# EAGLE design working (EAGLE 9.5.1)
COMPANY: ADAFRUIT INDUSTRIES; DRAWN: KTOWN; REV: A
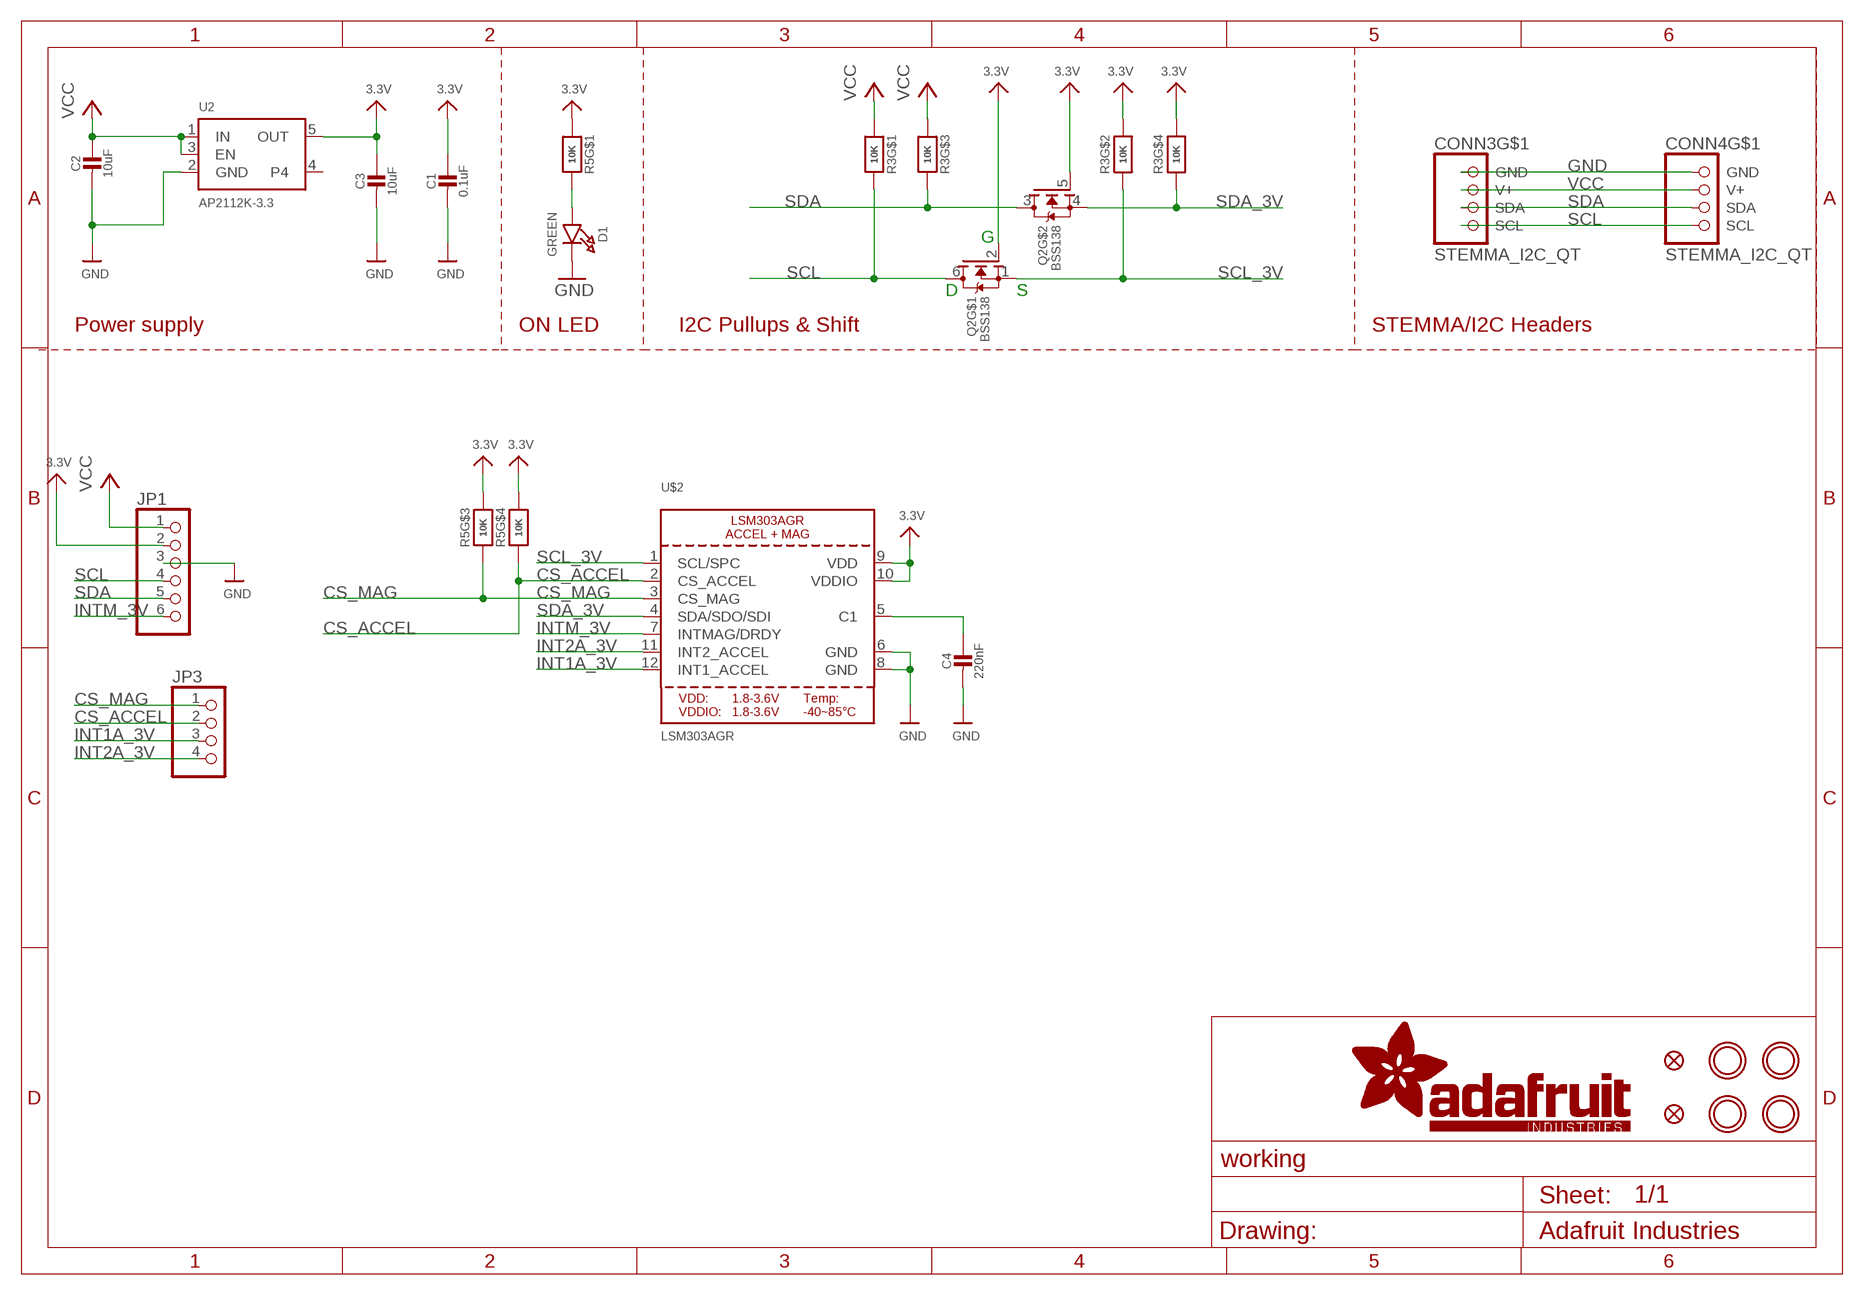
[diagram p0: schematic, sheet 1]

## Parts
C1  0.1uF  CAP_CERAMIC0603_NO  [0603-NO@1]
C2  10uF  CAP_CERAMIC0805-NOOUTLINE  [0805-NO]
C3  10uF  CAP_CERAMIC0805_10MGAP  [0805_10MGAP]
C4  220nF  CAP_CERAMIC0603_NO  [0603-NO@1]
CONN3  STEMMA_I2C_QT  [JST_SH4]
CONN4  STEMMA_I2C_QT  [JST_SH4]
D1  GREEN  LED0603_NOOUTLINE  [CHIPLED_0603_NOOUTLINE]
FID3  FIDUCIAL_1MM  [FIDUCIAL_1MM]
FID4  FIDUCIAL_1MM  [FIDUCIAL_1MM]
JP1  HEADER-1X670MIL  [1X06_ROUND_70]
JP3  HEADER-1X4ROUND  [1X04_ROUND]
Q2  BSS138  MOSFET-N_DUAL  [SOT363]
R3  10K  RESISTOR_4PACK  [RESPACK_4X0603]
R5  10K  RESISTOR_4PACK  [RESPACK_4X0603]
U2  AP2112K-3.3  VREG_SOT23-5  [SOT23-5]
U$1  MOUNTINGHOLE2.5  [MOUNTINGHOLE_2.5_PLATED]
U$2  LSM303AGR  [LGA12_2X2MM]
U$17  MOUNTINGHOLE2.5  [MOUNTINGHOLE_2.5_PLATED]
U$19  MOUNTINGHOLE2.5  [MOUNTINGHOLE_2.5_PLATED]
U$21  MOUNTINGHOLE2.5  [MOUNTINGHOLE_2.5_PLATED]

## Nets
3.3V [lowpower]: C1.1 C3.1 JP1.2 Q2.2(G) Q2.5(G) R3.2 R3.4 R5.1 R5.5 R5.6 U2.5(OUT) U$2.9(VDD) U$2.10(VDDIO)
CS_ACCEL: JP3.2 R5.4 U$2.2(CS_ACCEL)
CS_MAG: JP3.1 R5.3 U$2.3(CS_MAG)
GND [highpower]: C1.2 C2.2 C3.2 C4.2 CONN3.1(GND) CONN4.1(GND) D1.C JP1.3 U2.2(GND) U$2.6(GND) U$2.8(GND)
INT1A_3V: JP3.3 U$2.12(INT1_ACCEL)
INT2A_3V: JP3.4 U$2.11(INT2_ACCEL)
INTM_3V: JP1.6 U$2.7(INTMAG/DRDY)
N$1: D1.A R5.8
N$2: C4.1 U$2.5(C1)
SCL: CONN3.4(SCL) CONN4.4(SCL) JP1.4 Q2.6(D) R3.8
SCL_3V: Q2.1(S) R3.7 U$2.1(SCL/SPC)
SDA: CONN3.3(SDA) CONN4.3(SDA) JP1.5 Q2.3(D) R3.6
SDA_3V: Q2.4(S) R3.5 U$2.4(SDA/SDO/SDI)
VCC [highpower]: C2.1 CONN3.2(V+) CONN4.2(V+) JP1.1 R3.1 R3.3 U2.1(IN) U2.3(EN)
Unconnected: CONN3.MT1(MT) CONN3.MT2(MT) CONN4.MT1(MT) CONN4.MT2(MT) R5.2 R5.7 U2.4

## Notes on the sheet
- G
- D | S
- Power supply | ON LED | I2C Pullups & Shift | STEMMA/I2C Headers

## Library data of the parts
C1-C4 = microbuilder:CAP_CERAMIC: Ceramic Capacitors For new designs, use the packages preceded by an '_' character since they are more reliable: The following footprints should be used on most boards: _0402 - Standard footprint for regular board layouts _0603 - Standard footprint for regular board layouts _0805 - Standard footprint for regular board layouts _1206 - Standard footprint for regular board layouts For extremely tight-pitch boards where space is at a premium, the following 'micro-pitch' footprints can be used (smaller pads, no silkscreen outline, etc.): _0402MP - Micro-pitch footprint for very dense/compact boards _0603MP - Micro-pitch footprint for very dense/compact boards _0805MP - Micro-pitch footprint for very dense/compact boards _1206MP - Micro-pitch footprint for very dense/compact boards
CONN3 CONN4 = microbuilder:STEMMA_I2C
D1 = microbuilder:LED: LED 0603 - 0603 Surface Mount Package 2mA: Green LED - Low Power (3.9mcd, 2ma, 1.7Vf) - Digikey: 475-2709-2-ND Orange LED - Low Power (9.8mcd, 2ma, 1.8Vf) - Digikey: 475-1194-2-ND Red LED - Low Power (5mcd, 2ma, 1.8Vf) - Digikey: 475-1195-2-ND Yellow LED - Low Power (7mcd, 2ma, 1.8Vf) - Digikey: 475-1196-2-ND 5mA: Blue LED - Low Power (17mcd, 5ma, 2.9Vf) - Digikey: LNJ937W8CRACT-ND 0805 - 0805 Surface Mount Package 2mA: Red LED (8.8mcd, 2mA, 1.8Vf, Clear) - Low Power [Digikey: 475-2510-1-ND] Green LED (5mcd, 2mA, 1.8Vf, Clear) - Low Power [Digikey: 475-2730-1-ND] Yellow LED (11.3mcd, 2mA, 1.8Vf, Clear) - Low Power [Digikey: 475-2555-1-ND] 20mA: Red LED (104mcd, 20mA, Diffused) - LS R976 [Digikey: 475-1278-6-ND] Red LED (12mcd, 20mA, 2.0Vf, Clear) - APT2012EC [Digikey: 754-1128-1-ND] Green LED (15mcd, 20mA, 2.2Vf, Clear) - APT2012GC [Digikey: 754-1131-1-ND] Orange LED (160mcd, 20mA, 2.1Vf, Clear) - APT2012SECK [Digikey: 754-1130-1-ND] 1206 - 1206 Surface Mount Package Green LED (26mcd, 20mA, Diffused) - LG N971 [Digikey: 475-1407-6-ND] Red LED (15mcd, 20mA, Diffused) - LH N974 [Digikey: 475-1416-6-ND] Cree - Cree High-Power Surface Mount LEDs XPEBWT-L1-0000-00D50 - White 111lm 350mA 2.9Vf 6200K 110° XTEAWT-00-0000-00000LEE3 - White 114lm 350mA 2.85Vf 5000K 115° Everlight - Everlight 45-21 Series Surface Mount LEDs 45-21/QK2C-B2832AC2CB2/2T - Warm White 2000mcd 20mA 3.25Vf 3050K 120° 45-21/LK2C-B38452C4CB2/2T - Nuetral White 2000mcd 20mA 3.25Vf 4150K 120° 45-21/LK2C-B50634C6CB2/2T - Cold White 2200mcd 20mA 3.25Vf 5650K 120° PLCC2 Reverse Mount LS T77K-J1L2-1-0-2-R18-Z - Red 11.25mcd 2mA 1.8Vf 630nm 120° LO T77K-L1M2-24-Z - Orange 19.6mcd 2mA 1.8Vf 606nm 120° LY T77K-K2M1-26-Z - Yellow 15.7mcd 2mA 1.8Vf 587nm 120°
FID3 FID4 = microbuilder:FIDUCIAL: Fiducial Alignment Points Various fiducial points for machine vision alignment.; BOM: EXCLUDE
JP1 = microbuilder:HEADER-1X6: PIN HEADER
JP3 = microbuilder:HEADER-1X4: PIN HEADER
Q2 = microbuilder:MOSFET-N_DUAL: Dual N-Channel MOSFET SOT363 (2.0x1.25mm) 2N7002PS - 60V, 320mA [Digikey: 568-5984-1-ND]
R3 R5 = microbuilder:RESISTOR_4PACK: Resistor Packs (4 resistors) 4 x 0603 10K 1/16W - Digikey: YC164J-10KCT-ND
U2 = microbuilder:VREG_SOT23-5: SOT23-5 Fixed Voltage Regulators Part Current Out V Out V In V Dropout θJA (°C/W) TJ (°C) Digikey Part No. ADP121 150mA 3.3V 3.4-5.5V 0.09V @ 150mA -- -- ADP121-AUJZ33R7CT-ND ADP121 150mA 3.0V 3.1-5.5V 0.09V @ 150mA -- -- ADP121-AUJZ30R7CT-ND ADP122 300mA 3.3V 3.4-5.5V 0.085V @ 300mA -- -- ADP122AUJZ-3.3-R7CT-ND ADP1712 300mA 3.3V 3.5-5.5V 0.17V @ 300mA -- -- ADP1712AUJZ-3.3-R7TR-ND AP7311 (Low Cost) 150mA 3.3V 3.5-6V 0.15V @ 150mA -- -- AP7311-33WG-7DICT-ND LD39015M18R 150mA 1.8V 1.9V-5.5V 0.08V @ 100mA -- -- 497-6977-1-ND LP2985A-33DBVR 150mA 3.3V 3.3-16V 0.28V @ 150mA 206 150 296-18479-1-ND MCP1824T-3302E/OT 300mA 3.3V 3.5V-6V 0.2V @ 300mA -- -- MCP1824T-3302E/OTCT-ND MIC5205-2.5YM5 TR 150mA 2.5V 2.7-16V 0.165V @ 150mA -- -- 576-1257-2-ND MIC5205-3.0YM5 TR 150mA 3.0V 3.2V-16V 0.165V @ 150mA -- -- 576-1258-2-ND MIC5205-3.3YM5 TR 150mA 3.3V 3.5V-16V 0.165V @ 150mA -- -- 576-1259-2-ND TPS780330220 150mA 3.3V+2.2V 3.6-5.5V 250mV Max -- -- 296-23332-1-ND TDA3663/N1,135 100mA 3.3V 3.5-45V 0.18V @ 50mA -- -- 568-5343-1-ND Max operating temp can be calculated using θJA, TJ (max junction temperature), and power in watts. Set the "Maximum Ambient Temperature" until it reaches TJ ("Max Junction Temperature"), which is the absolute limit for safe use of the regulator: Heat Sink Temperature Calculator <http://www.daycounter.com/Calculators/Heat-Sink-Temperature-Calculator.phtml> For example, With 12V source into a 3.3V LP2985 and a 30mA load, we are dissipating (12V-3.3V) * 0.03A = 0.261W. With a θJA of 206 °C/W, a TJ of 150°C, and 261mW we can safely use the chip without a heat sink up to 75°C (=147.1°C Junction Temperature).
U$1 U$17 U$19 U$21 = microbuilder:MOUNTINGHOLE: Mounting Hole For #2 screws (0.086"/2.18mm width, 0.094"/2.4mm hole) use 2.5mm; BOM: EXCLUDE
U$2 = microbuilder:LSM303AGR: LSM303AGR - 3-Axis Accelerometer and Magnetometer Accel Range: ±2/±4/±8/±16 g Mag Range: ±50 gauss 16-bit data output

## Net classes
1 highpower: width 0.406 mm, drill 0.483 mm
2 lowpower: width 0.305 mm, drill 0.483 mm

## Board
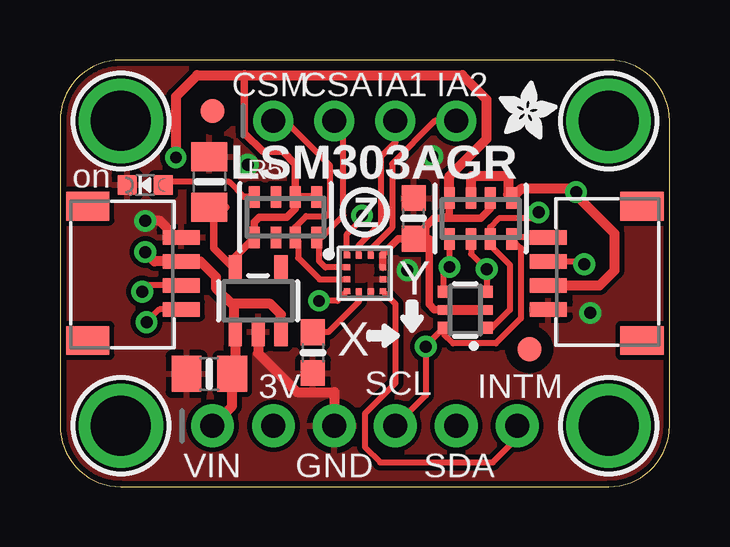
[diagram p1: board, top side]
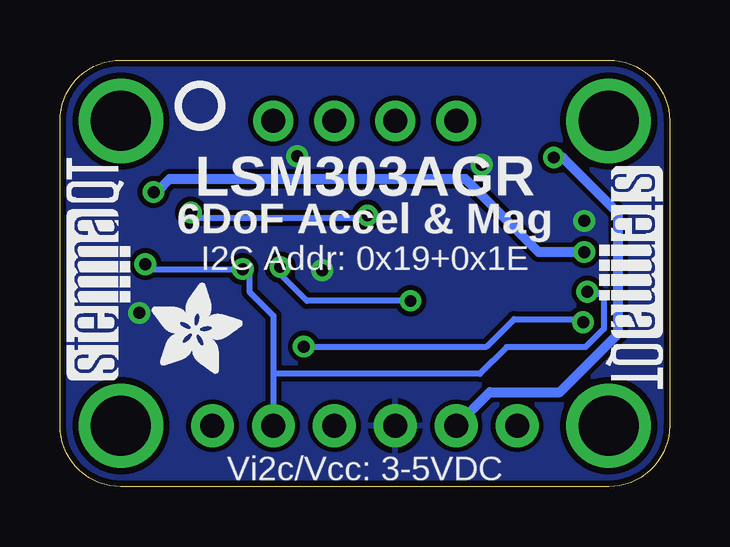
[diagram p2: board, bottom side, seen from below]

Size 25.4 x 17.78 mm. Coordinates in mm from the lower left corner, seen from the top.
Outline: 0,15.24 0,2.54 arc90 2.54,0 22.86,0 arc90 25.4,2.54 25.4,15.24 arc90 22.86,17.78 2.54,17.78 arc90 0,15.24
Copper layers (1*16): Top 0.035mm / dielectric 1.5mm / Bottom 0.035mm
Design rules "adafruit *": minimum track width 8mil, minimum drill 15.5mil, track to track 8mil, track to pad 8mil, pad to pad 8mil, via to via 8mil, smd to smd 8mil, copper to edge 10mil, drill to drill 8mil, minimum pad ring 10mil, minimum via ring 8mil, stop-mask expansion 2mil, vias tented up to drill 20mil, thermal gap 10mil

### Footprints (pad centres in the part's own frame; a part is rotated, then mirrored left to right if it is on the bottom)
0603-NO@1 = smd 1.075 x 1: 1 -0.85,0; 2 0.85,0
0805-NO = smd 1.24 x 1.5: 1 -0.95,0; 2 0.95,0
0805_10MGAP = smd 1.2 x 1.5: 1 -1.05,0; 2 1.05,0
JST_SH4 = smd 0.6 x 1.55: 1 -1.5,2.514; 2 -0.5,2.514; 3 0.5,2.514; 4 1.5,2.514 | smd 1.2 x 1.8: MT1 -2.8,-1.386; MT2 2.8,-1.386
CHIPLED_0603_NOOUTLINE = smd 0.8 x 0.8: A 0,-0.75; C 0,0.75
FIDUCIAL_1MM = smd 1 x 1: 1 0,0
1X06_ROUND_70 = drill 1 pad 1.778: 1 -6.35,0; 2 -3.81,0; 3 -1.27,0; 4 1.27,0; 5 3.81,0; 6 6.35,0
1X04_ROUND = drill 1 pad 1.676: 1 -3.81,0; 2 -1.27,0; 3 1.27,0; 4 3.81,0
SOT363 = smd 0.5 x 0.5: 1 -0.75,-0.9; 3 0.75,-0.9; 4 0.75,0.9; 6 -0.75,0.9 | smd 0.4 x 0.5: 2 0,-0.9; 5 0,0.9
RESPACK_4X0603 = smd 0.45 x 0.9: 1 -1.3,-0.85; 2 -0.4,-0.85; 3 0.4,-0.85; 4 1.3,-0.85; 5 1.3,0.85; 6 0.4,0.85; 7 -0.4,0.85; 8 -1.3,0.85
SOT23-5 = smd 0.55 x 1.2: 1 -0.95,-1.3; 2 0,-1.3; 3 0.95,-1.3; 4 0.95,1.3; 5 -0.95,1.3
MOUNTINGHOLE_2.5_PLATED = drill 2.5 pad 3.2: P$1 0,0
LGA12_2X2MM = smd 0.275 x 0.25: 1 -0.75,0.75; 2 -0.75,0.25; 3 -0.75,-0.25; 4 -0.75,-0.75; 7 0.75,-0.75; 8 0.75,-0.25; 9 0.75,0.25; 10 0.75,0.75 | smd 0.25 x 0.275: 5 -0.25,-0.75; 6 0.25,-0.75; 11 0.25,0.75; 12 -0.25,0.75

### Placement (x,y rotation side)
C1  14.73,11.18 90 top
C2  6.22,4.7 180 top
C3  6.22,12.7 90 top
C4  10.54,5.59 270 top
CONN3  22.86,8.89 90 top
CONN4  2.54,8.89 270 top
D1  3.56,12.57 90 top
FID3  19.56,5.73 0 top
FID4  6.35,15.66 0 top
JP1  12.7,2.54 0 top
JP3  12.7,15.24 0 top
Q2  16.89,7.37 90 top
R3  17.53,11.18 180 top
R5  9.4,11.23 0 top
U2  8.26,7.75 0 top
U$1  2.54,15.24 0 top
U$2  12.7,8.89 0 top
U$17  22.86,15.24 0 top
U$19  2.54,2.54 0 top
U$20  [ADAFRUIT_3.5MM]  21.59,4.7 0 bottom
U$21  22.86,2.54 0 top
U$25  [PCBFEAT-REV-040]  19.56,15.88 0 bottom
U$30  [STEMMAQT]  22.48,4.45 90 bottom
U$31  [STEMMAQT]  2.92,13.34 270 bottom
U$40  [ADAFRUIT_2.5MM]  18.29,14.48 0 top

### Tracks (layer width: path | path; a pad name or v marks a point on that pad's centre or on a via)
3.3V  (via drill 0.48)
  Top 0.305: R3.2 17.93,11.58 17.53,11.18 16.04,11.18 | R3.4 16.23,11.36 16.04,11.18 | C1.1 14.1,10.33 13.45,9.68 U$2.10 U$2.9 | C1.1 15.25,10.33 | 15.25,10.33 15.38,10.33 15.38,7.6 15.59,7.38 16.37,7.38 16.38,7.37 | 15.59,11.18 15.25,10.83 15.25,10.33 | R5.6 R5.5 | 6.9,11.65 C3.1 6.42,11.46 6.42,9.94 U2.5 7.3,9.58 R5.1 8.1,11.02 8.31,11.23 9.45,11.23 9.8,11.58 R5.6 | 7.68,17.14 7.68,14.73 8.45,13.97 9.27,13.97 9.8,13.44 R5.6 | C1.1 15.58,11.18 15.59,11.18 | 16.04,11.18 15.59,11.18
  Top 0.406: Q2.5 16.38,7.37 Q2.2 | R3.4 16.23,12.94 17.78,14.5 17.78,16.13 16.76,17.14 7.68,17.14 5.71,17.14 4.83,16.26 v4.83,13.72
  Bottom 0.406: JP1.2 7.49,3.94 4.57,3.94 2.13,6.38 2.13,11.4 4.45,13.72 v4.83,13.72
CS_ACCEL
  Top 0.203: 10.79,10.28 R5.4
  Top 0.254: U$2.2 11.05,9.14 10.79,9.4 10.79,10.28 | JP3.2 11.81,14.86 11.81,11.3 10.88,10.38 R5.4
CS_MAG
  Top 0.254: U$2.3 10.81,8.64 9.93,9.53 9.93,10.25 R5.3 9.8,10.81 10.26,11.27 11.09,11.27 11.25,11.44 11.25,13.38 9.39,15.24 JP3.1
GND  (via drill 0.5)
  Top 0.406: CONN4.1 4.85,10.39 4.17,11.07 v3.56,11.07 | U2.2 8.26,5.57 9.88,3.94 11.43,3.94 JP1.3
  other vias: 22.1,7.24 14.48,9.02 15.52,13.77 7.82,13.41
  pour Top: 0,17.78 25.4,17.78 25.4,0 0,0
  pour Bottom: 0,17.78 25.4,17.78 25.4,0 0,0
INT1A_3V
  Top 0.254: U$2.12 12.45,10.07 13.38,11 13.38,13.76 13.97,14.35 JP3.3
INT2A_3V
  Top 0.254: U$2.11 12.95,9.89 13.84,10.78 13.84,13.46 15.62,15.24 JP3.4
INTM_3V
  Top 0.254: JP1.6 19.05,2.03 18.03,1.02 13.34,1.02 12.7,1.65 12.7,3.05 13.97,4.32 13.97,7.62 U$2.7
N$1
  Top 0.254: R5.8 7.67,12.08 7.04,12.7 4.43,12.7 D1.A
N$2
  Top 0.254: U$2.5 12.45,7.71 11.18,6.44 C4.1
SCL  (via drill 0.5)
  Top 0.254: CONN3.4 18.89,10.39 R3.8 19.21,9.95 19.21,7.01 18.16,5.97 16.38,5.97 15.99,6.36 Q2.6 15.24,5.87 v15.24,5.84 15.24,3.81 JP1.4 | CONN4.4 4.14,7.39 v3.61,6.86
  Bottom 0.254: v15.24,5.84 7.62,5.84 6.48,6.99 3.73,6.99 v3.61,6.86
SCL_3V  (via drill 0.48, 0.5)
  Top 0.254: v19.94,11.43 19.68,11.18 18.29,11.18 17.93,10.81 R3.7 17.93,10.06 18.75,9.24 18.75,7.37 18,6.62 Q2.1 | v12.59,11.3 12.59,11.17 11.95,10.53 U$2.1
  Bottom 0.254: v12.59,11.3 12.72,11.18 19.68,11.18 v19.94,11.43
SDA  (via drill 0.5)
  Top 0.254: R3.6 17.13,9.69 17.75,9.07 v17.79,9.07 17.79,9.13 Q2.3 | CONN4.3 3.43,8.39 v3.43,8.12 | CONN3.3 21.73,9.39 v21.84,9.27
  Bottom 0.254: v3.43,8.12 3.4,8.15 3.07,8.15 2.74,7.82 2.74,6.58 3.5,5.82 6.79,5.82 7.91,4.7 16.51,4.7 | v21.84,9.27 21.64,9.07 v17.79,9.07 17.71,9.07 17.51,8.87 17.51,8.13 16.51,7.13 16.51,4.7 | 16.51,4.7 JP1.5
SDA_3V  (via drill 0.48)
  Top 0.254: Q2.4 15.99,8.92 v16.23,9.15 R3.5 | U$2.4 11.56,7.75 v10.79,7.75
  Bottom 0.254: v10.79,7.75 15.11,7.75 16.23,8.86 v16.23,9.15
VCC  (via drill 0.5)
  Top 0.406: R3.3 17.13,12.94 17.14,12.95 18.67,12.95 18.67,12.18 R3.1 19.21,12.41 21.38,12.41 v21.5,12.28 21.5,12.15 23.11,10.54 23.11,9.02 22.49,8.39 CONN3.2 | v3.56,9.78 3.94,9.39 CONN4.2 5.85,9.39 6.5,8.74 6.5,8.28 7.24,7.54 | 7.24,7.54 7.24,7.62 8.76,7.62 9.21,7.18 U2.3 | 7.24,7.54 7.24,6.45 U2.1 7.3,4.83 C2.1 7.17,3.36 JP1.1
  Bottom 0.406: v21.5,12.28 21.38,12.28 20.83,12.83 8.51,12.83 5.46,9.78 v3.56,9.78

### Text on the board
tPlace: CSM | CSA | IA1 | IA2 | LSM303AGR | on | Z | Y | X | 3V | SCL | INTM | VIN | GND | SDA
bPlace: LSM303AGR | 6DoF Accel & Mag | I2C Addr: 0x19+0x1E | Vi2c/Vcc: 3-5VDC